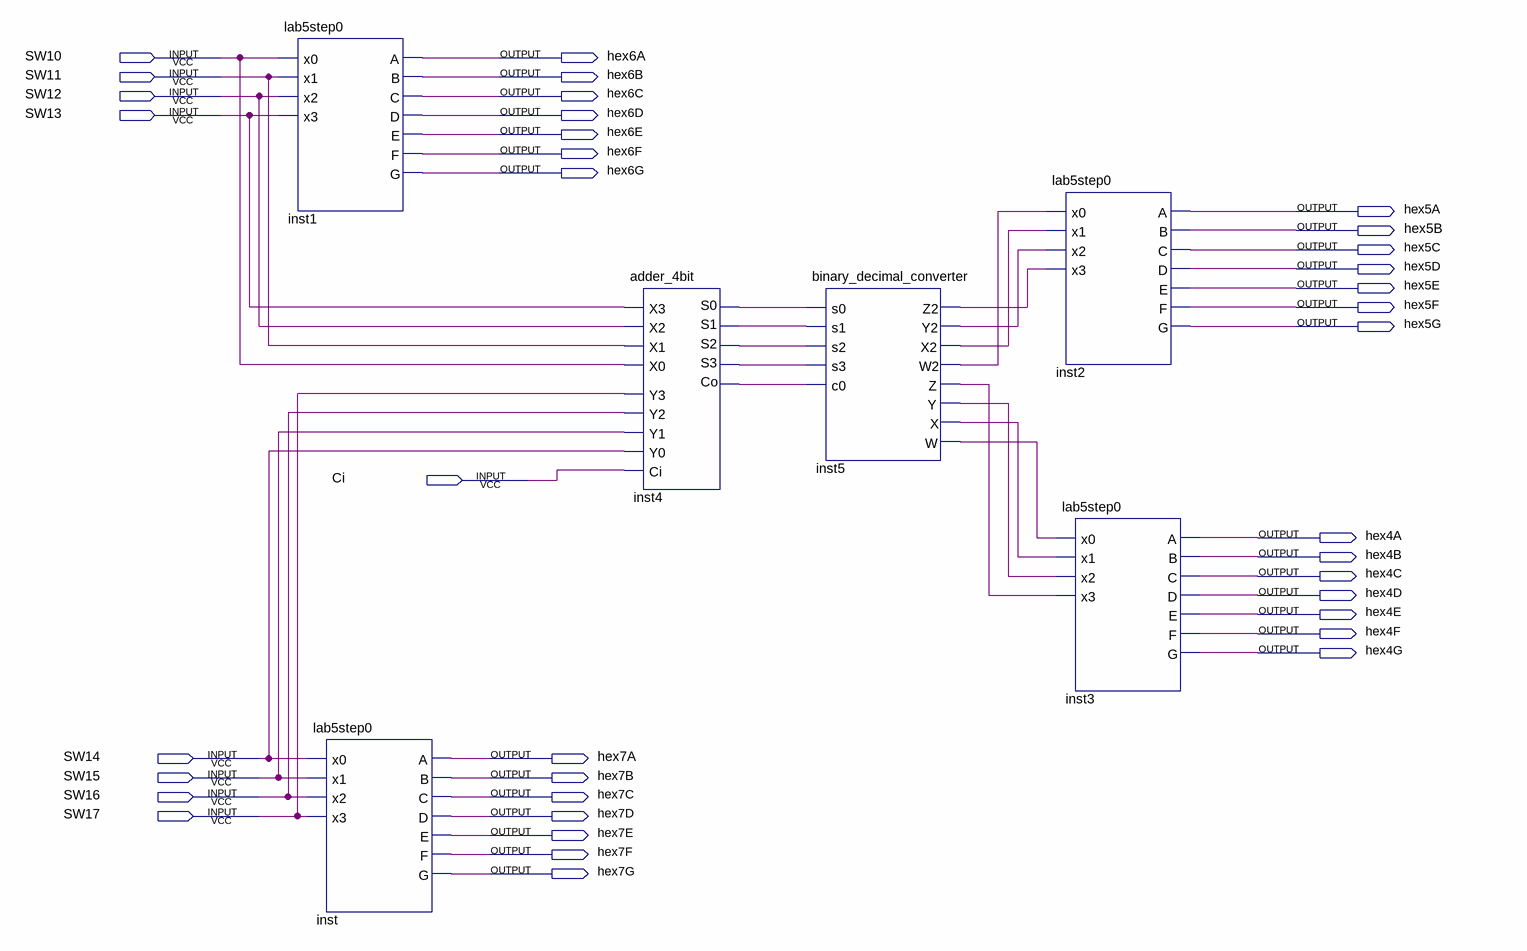
[diagram p0: schematic sheet]
// Quartus schematic lab6.bdf as structural Verilog: 6 symbols, 37 pins
module lab6 (
  input  SW10,
  input  SW11,
  input  SW12,
  input  SW13,
  input  Ci,
  input  SW14,
  input  SW15,
  input  SW16,
  input  SW17,
  output hex6A,
  output hex6B,
  output hex6C,
  output hex6D,
  output hex6E,
  output hex6F,
  output hex6G,
  output hex5A,
  output hex5B,
  output hex5C,
  output hex5D,
  output hex5E,
  output hex5F,
  output hex5G,
  output hex4A,
  output hex4B,
  output hex4C,
  output hex4D,
  output hex4E,
  output hex4F,
  output hex4G,
  output hex7A,
  output hex7B,
  output hex7C,
  output hex7D,
  output hex7E,
  output hex7F,
  output hex7G
);

  wire inst4_co, inst4_s0, inst4_s1, inst4_s2, inst4_s3, inst5_w, inst5_w2, inst5_x, inst5_x2, inst5_y,
       inst5_y2, inst5_z, inst5_z2;

  lab5step0 inst1 (
    .x0(SW10), .x1(SW11), .x2(SW12), .x3(SW13), .A(hex6A), .B(hex6B), .C(hex6C), .D(hex6D), .E(hex6E),
    .F(hex6F), .G(hex6G));
  lab5step0 inst (
    .x0(SW14), .x1(SW15), .x2(SW16), .x3(SW17), .A(hex7A), .B(hex7B), .C(hex7C), .D(hex7D), .E(hex7E),
    .F(hex7F), .G(hex7G));
  adder_4bit inst4 (
    .X3(SW13), .Y3(SW17), .X2(SW12), .Y2(SW16), .X1(SW11), .Y1(SW15), .X0(SW10), .Y0(SW14), .Ci(Ci),
    .S0(inst4_s0), .S1(inst4_s1), .S2(inst4_s2), .S3(inst4_s3), .Co(inst4_co));
  binary_decimal_converter inst5 (
    .s0(inst4_s0), .s1(inst4_s1), .s2(inst4_s2), .s3(inst4_s3), .c0(inst4_co), .Z2(inst5_z2), .Y2(inst5_y2),
    .X2(inst5_x2), .W2(inst5_w2), .Z(inst5_z), .Y(inst5_y), .X(inst5_x), .W(inst5_w));
  lab5step0 inst2 (
    .x0(inst5_w2), .x1(inst5_x2), .x2(inst5_y2), .x3(inst5_z2), .A(hex5A), .B(hex5B), .C(hex5C), .D(hex5D),
    .E(hex5E), .F(hex5F), .G(hex5G));
  lab5step0 inst3 (
    .x0(inst5_w), .x1(inst5_x), .x2(inst5_y), .x3(inst5_z), .A(hex4A), .B(hex4B), .C(hex4C), .D(hex4D),
    .E(hex4E), .F(hex4F), .G(hex4G));
endmodule
